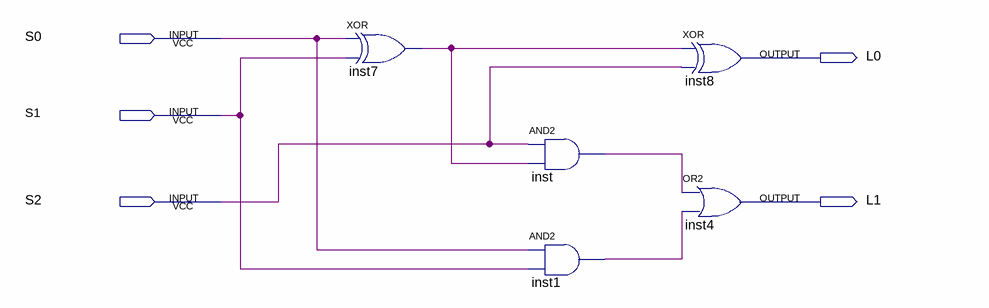
[diagram p0: schematic sheet]
// Quartus schematic exercise1.bdf as structural Verilog: 5 symbols, 5 pins
module exercise1 (
  input  S0,
  input  S1,
  input  S2,
  output L0,
  output L1
);

  wire inst1_out, inst7_out, inst_out;

  xor inst7 (inst7_out, S0, S1);
  and inst (inst_out, S2, inst7_out);
  and inst1 (inst1_out, S0, S1);
  xor inst8 (L0, inst7_out, S2);
  or inst4 (L1, inst_out, inst1_out);
endmodule
